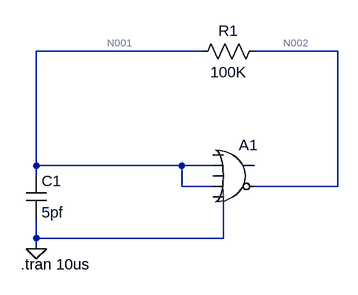
[diagram p0: schematic Astable multivibrator.asc]
Astable multivibrator.asc, the LTspice schematic file:
Version 4
SHEET 1 880 680
WIRE 224 0 -32 0
WIRE 432 0 304 0
WIRE -32 176 -32 0
WIRE 192 176 -32 176
WIRE 240 176 192 176
WIRE -32 192 -32 176
WIRE 192 208 192 176
WIRE 240 208 192 208
WIRE 432 208 432 0
WIRE 432 208 304 208
WIRE -32 288 -32 256
WIRE 256 288 256 224
WIRE 256 288 -32 288
WIRE -32 304 -32 288
FLAG -32 304 0
SYMBOL Digital\\or 272 128 R0
SYMATTR InstName A1
SYMATTR SpiceLine VHigh=+5v
SYMATTR SpiceLine2 Trise=7ns Td=11ns
SYMBOL res 320 -16 R90
WINDOW 0 0 56 VBottom 2
WINDOW 3 32 56 VTop 2
SYMATTR InstName R1
SYMATTR Value 100K
SYMBOL cap -48 192 R0
SYMATTR InstName C1
SYMATTR Value 5pf
TEXT -56 328 Left 2 !.tran 10us

The netlist it stands for:
* Astable multivibrator.asc
A1 0 N001 0 N001 0 N002 0 0 OR VHigh=+5v Trise=7ns Td=11ns
R1 N002 N001 100K
C1 N001 0 5pf
.tran 10us
.backanno
.end

* Results of the author's LTspice run, read from the files saved beside the schematic
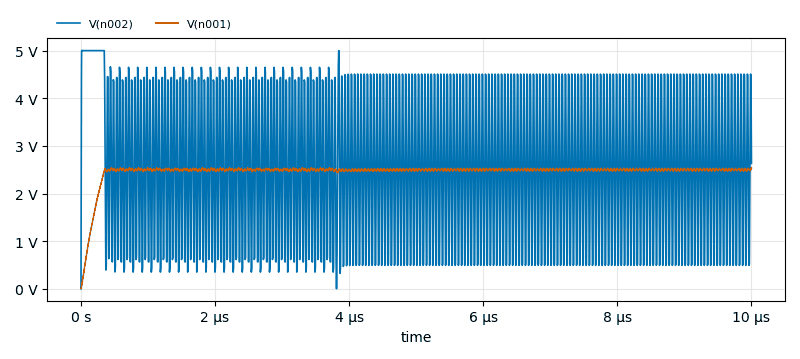
[diagram p1: Transient Analysis of Astable multivibrator.asc, plotted from the saved traces]
* Transient Analysis, 1 run:
*   V(n002): min 697.5 µV, max 5.006 V, average 2.586 V, rms 3.053 V, last 2.633 V
*   V(n001): min 0 V, max 2.537 V, average 2.46 V, rms 2.472 V, last 2.537 V